# EAGLE schematic si4012 RTTY 01 (EAGLE 7.7.0)
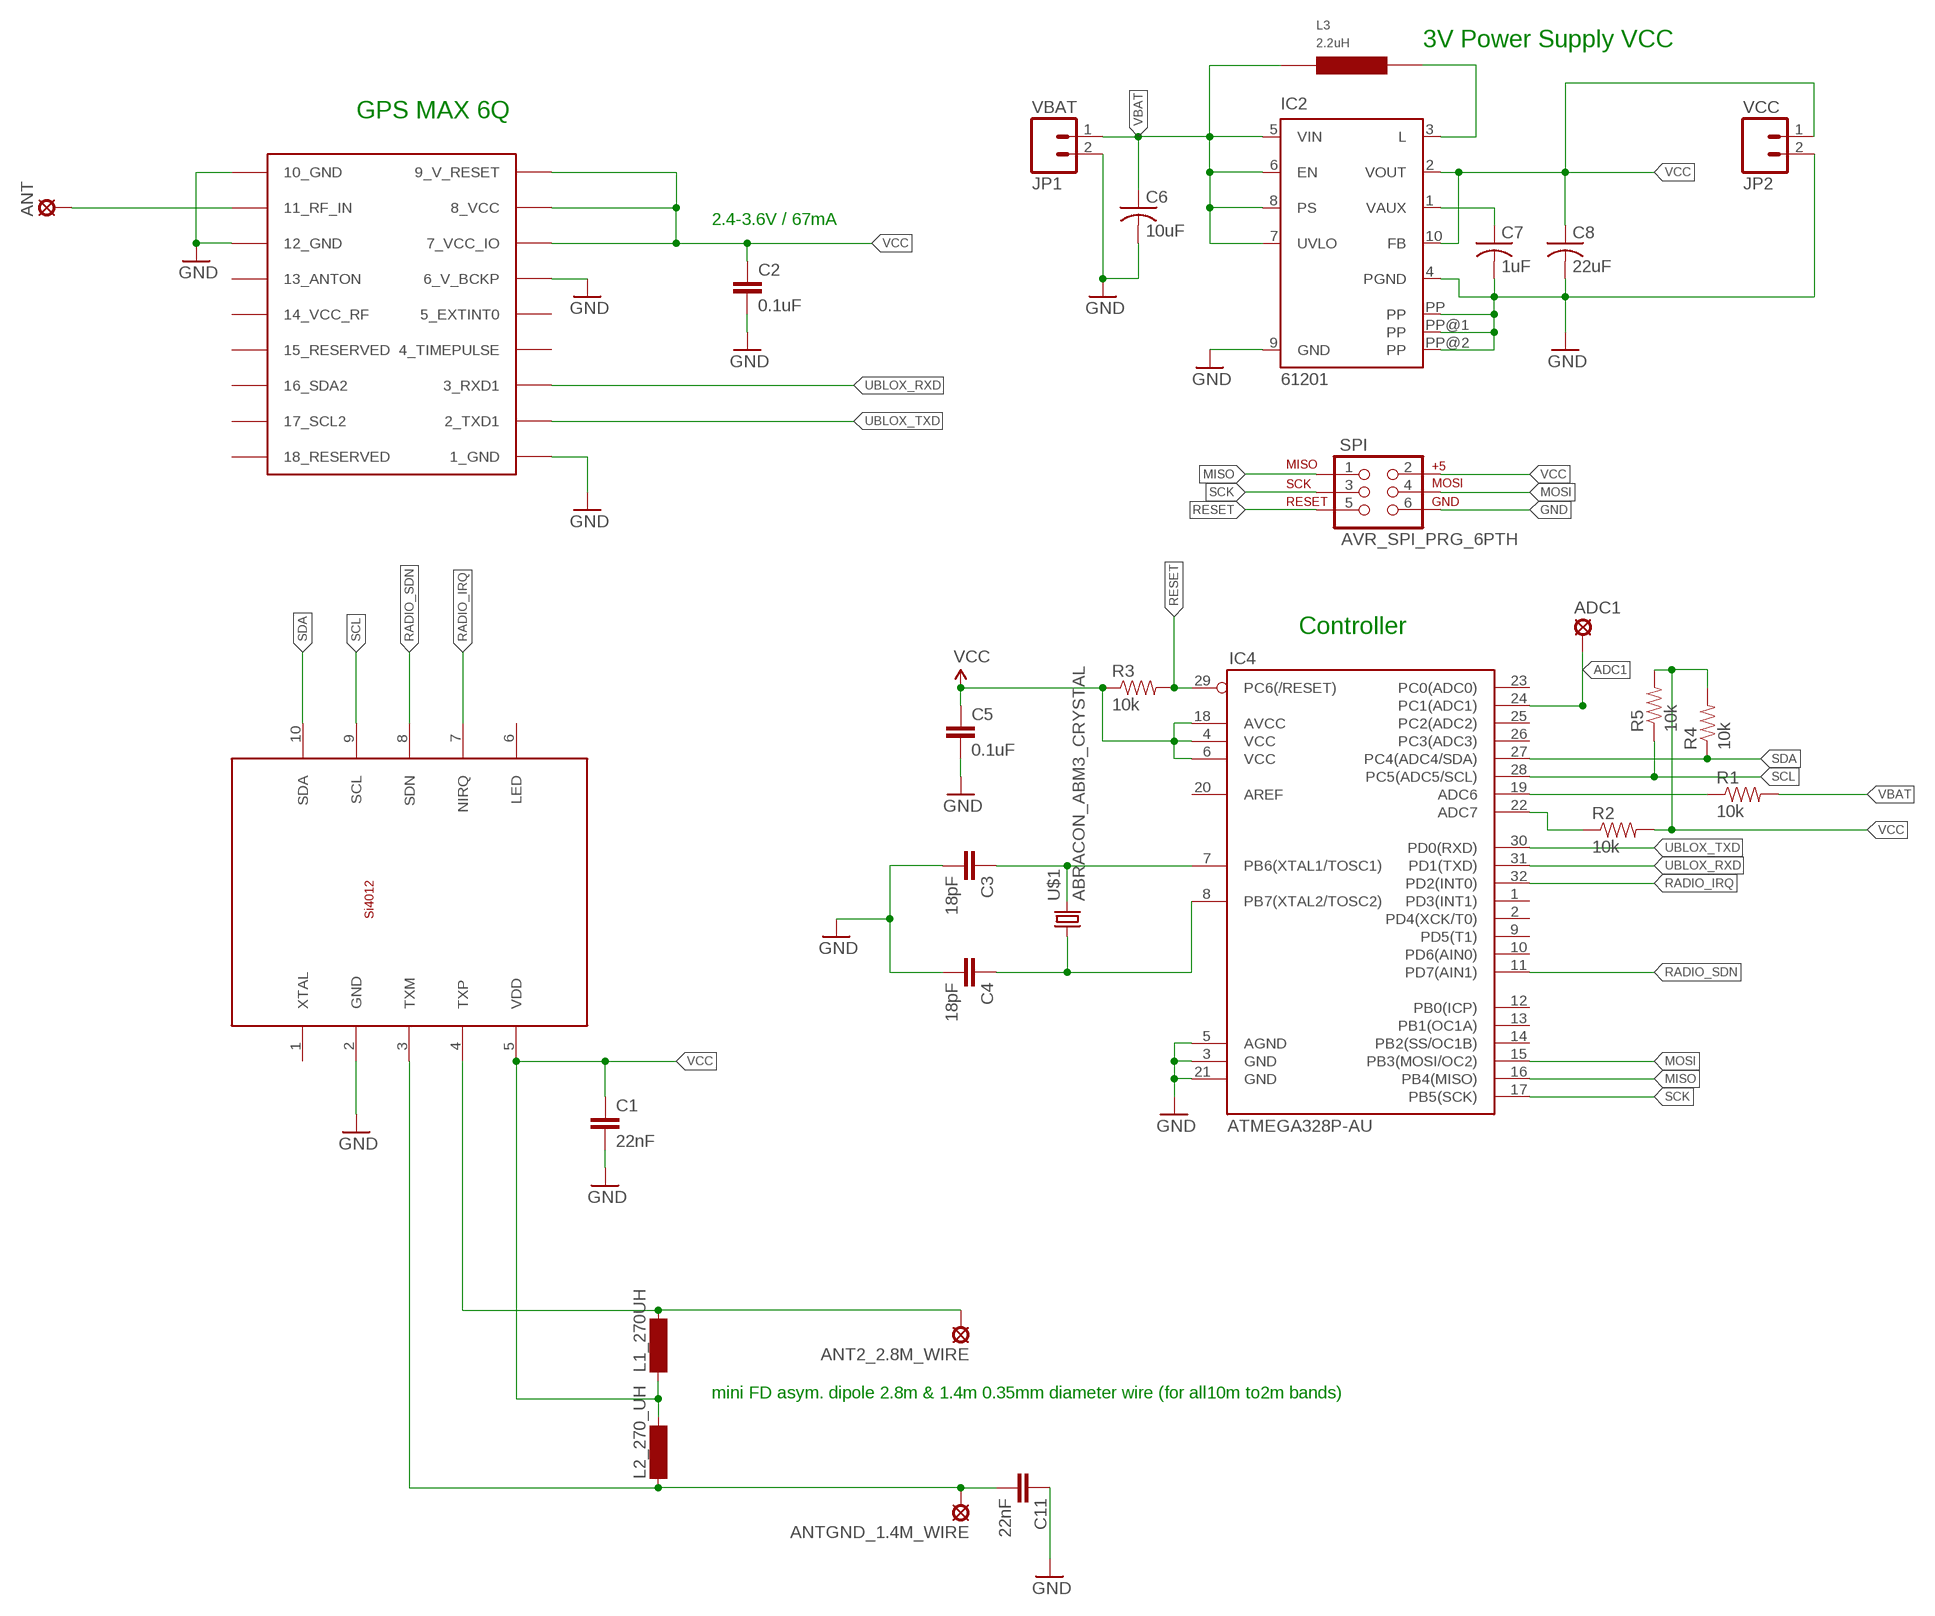
[diagram p0: schematic, sheet 1]

## Parts
ADC1  LSP10  [LSP10]
ANT  LSP10  [LSP10]
ANT2_2.8M_WIRE  LSP10  [LSP10]
ANTGND_1.4M_WIRE  LSP10  [LSP10]
C1  22nF  CAP0402-CAP  [0402-CAP]
C2  0.1uF  CAP0402-CAP  [0402-CAP]
C3  18pF  CAP0402-CAP  [0402-CAP]
C4  18pF  CAP0402-CAP  [0402-CAP]
C5  0.1uF  CAP0402-CAP  [0402-CAP]
C6  10uF  C-USC1206  [C1206]
C7  1uF  C-USC1206  [C1206]
C8  22uF  C-USC1206  [C1206]
C11  22nF  CAP0402-CAP  [0402-CAP]
IC2  61201  TPS61201  [S-PDSO-N10]
IC4  ATMEGA328P-AU  ATMEGA168  [TQFP32-08]
IC5  UBLOX_MAX-6  [UBLOX_MAX-6]
JP1  VBAT  M02PTH  [1X02]
JP2  VCC  M02PTH  [1X02]
L1_270UH  SM-1206  [SM-1206]
L2_270_UH  SM-1206  [SM-1206]
L3  2.2uH  LPS3015  [LPS3015]
R1  10k  RESISTOR0402-RES  [0402-RES]
R2  10k  RESISTOR0402-RES  [0402-RES]
R3  10k  RESISTOR0402-RES  [0402-RES]
R4  10k  RESISTOR0402-RES  [0402-RES]
R5  10k  RESISTOR0402-RES  [0402-RES]
SPI  AVR_SPI_PRG_6PTH  [2X3]
U$1  ABRACON_ABM3_CRYSTAL  [ABRACON_ABM3_CRYSTAL]
U$2  SI4012  [MSOP_10]

## Nets
ADC1: ADC1.MP IC4.24(PC1(ADC1))
ADC6: IC4.19(ADC6) R1.1
ADC7: IC4.22(ADC7) R2.1
ANT: ANT.MP IC5.11_RF_IN
GND [vcc]: C1.2 C2.2 C3.2 C4.2 C5.2 C6.2 C7.2 C8.2 C11.1 IC2.4(PGND) IC2.9(GND) IC2.PP IC2.PP@1(PP) IC2.PP@2(PP) IC4.3(GND) IC4.5(AGND) IC4.21(GND) IC5.1_GND IC5.6_V_BCKP IC5.10_GND IC5.12_GND JP1.2 JP2.2 SPI.6 U$2.2(GND)
MISO: IC4.16(PB4(MISO)) SPI.1
MOSI: IC4.15(PB3(MOSI/OC2)) SPI.4
N$2: ANTGND_1.4M_WIRE.MP C11.2 L2_270_UH.1 U$2.3(TXM)
N$4: IC2.3(L) L3.P$2
N$9: C3.1 IC4.7(PB6(XTAL1/TOSC1)) U$1.P$2
N$10: C4.1 IC4.8(PB7(XTAL2/TOSC2)) U$1.P$1
N$19: C7.1 IC2.1(VAUX)
RADIO_IRQ: IC4.32(PD2(INT0)) U$2.7(NIRQ)
RADIO_SDN: IC4.11(PD7(AIN1)) U$2.8(SDN)
RESET: IC4.29(PC6(/RESET)) R3.2 SPI.5
SCK: IC4.17(PB5(SCK)) SPI.3
SCL: IC4.28(PC5(ADC5/SCL)) R5.1 U$2.9(SCL)
SDA: IC4.27(PC4(ADC4/SDA)) R4.1 U$2.10(SDA)
TXP: ANT2_2.8M_WIRE.MP L1_270UH.2 U$2.4(TXP)
UBLOX_RXD: IC4.31(PD1(TXD)) IC5.3_RXD1
UBLOX_TXD: IC4.30(PD0(RXD)) IC5.2_TXD1
VBAT [vcc]: C6.1 IC2.5(VIN) IC2.6(EN) IC2.7(UVLO) IC2.8(PS) JP1.1 L3.P$1 R1.2
VCC [vcc]: C1.1 C2.1 C5.1 C8.1 IC2.2(VOUT) IC2.10(FB) IC4.4(VCC) IC4.6(VCC) IC4.18(AVCC) IC5.7_VCC_IO IC5.8_VCC IC5.9_V_RESET JP2.1 L1_270UH.1 L2_270_UH.2 R2.2 R3.1 R4.2 R5.2 SPI.2 U$2.5(VDD)
Unconnected: IC4.1(PD3(INT1)) IC4.2(PD4(XCK/T0)) IC4.9(PD5(T1)) IC4.10(PD6(AIN0)) IC4.12(PB0(ICP)) IC4.13(PB1(OC1A)) IC4.14(PB2(SS/OC1B)) IC4.20(AREF) IC4.23(PC0(ADC0)) IC4.25(PC2(ADC2)) IC4.26(PC3(ADC3)) IC5.4_TIMEPULSE IC5.5_EXTINT0 IC5.13_ANTON IC5.14_VCC_RF IC5.15_RESERVED IC5.16_SDA2 IC5.17_SCL2 IC5.18_RESERVED U$2.1(XTAL) U$2.6(LED)

## Notes on the sheet
- 3V Power Supply VCC
- GPS MAX 6Q
- 2.4-3.6V / 67mA
- Controller
- mini FD asym. dipole 2.8m & 1.4m 0.35mm diameter wire (for all10m to2m bands)

## Library data of the parts
ADC1 ANT ANT2_2.8M_WIRE ANTGND_1.4M_WIRE = solpad:LSP10: SOLDER PAD drill 1.0 mm, distributor Buerklin, 12H555
C1-C5 C11 = SparkFun:CAP: Capacitor Standard 0603 ceramic capacitor, and 0.1" leaded capacitor.
C6-C8 = rcl:C-US: CAPACITOR, American symbol
IC2 = texas:TPS6120*: LOW INPUT VOLTAGE SYNCHRONOUS BOOST CONVERTER WITH 1.3-A SWITCHES Source: http://focus.ti.com/lit/ds/symlink/tps61200.pdf; MPN: TPS61201DRCT; OC_FARNELL: unknown; OC_NEWARK: 37M0068
IC4 = SparkFun:ATMEGA168
IC5 = ava:UBLOX_MAX-6: UBLOX MAX-6
JP1 JP2 = SparkFun:M02: Header 2 Standard 2-pin 0.1" header. Use with straight break away headers (SKU : PRT-00116), right angle break away headers (PRT-00553), swiss pins (PRT-00743), machine pins (PRT-00117), and female headers (PRT-00115). Molex polarized connector foot print use with SKU : PRT-08233 with associated crimp pins and housings.
L1_270UH L2_270_UH = inductor-neosid:SM-1206: INDUCTOR SMD chip inductor; OC_FARNELL: unknown; OC_NEWARK: unknown
L3 = inductor-coilcraft-TK:LPS3015: LPS3015 Series Low Profile Shielded Power Inductors http://www.coilcraft.com/lps3015.cfm <0.058>
R1-R5 = SparkFun:RESISTOR: Resistor Basic schematic elements and footprints for 0603, 1206, and PTH resistors.
SPI = SparkFun:AVR_SPI_PRG_6: AVR ISP 6 Pin This is the reduced ISP connector for AVR programming. Common on Arduino. This footprint will take up less PCB space and can be used with a 10-pin to 6-pin adapter such as SKU: BOB-08508
U$1 = ava:ABRACON_ABM3_CRYSTAL
U$2 = BillPorter:SI4012: FSK/OOK RF

## Net classes
0 default: width 0.203 mm
1 vcc: width 0.254 mm